# EAGLE schematic baseboard (EAGLE 9.6.1)
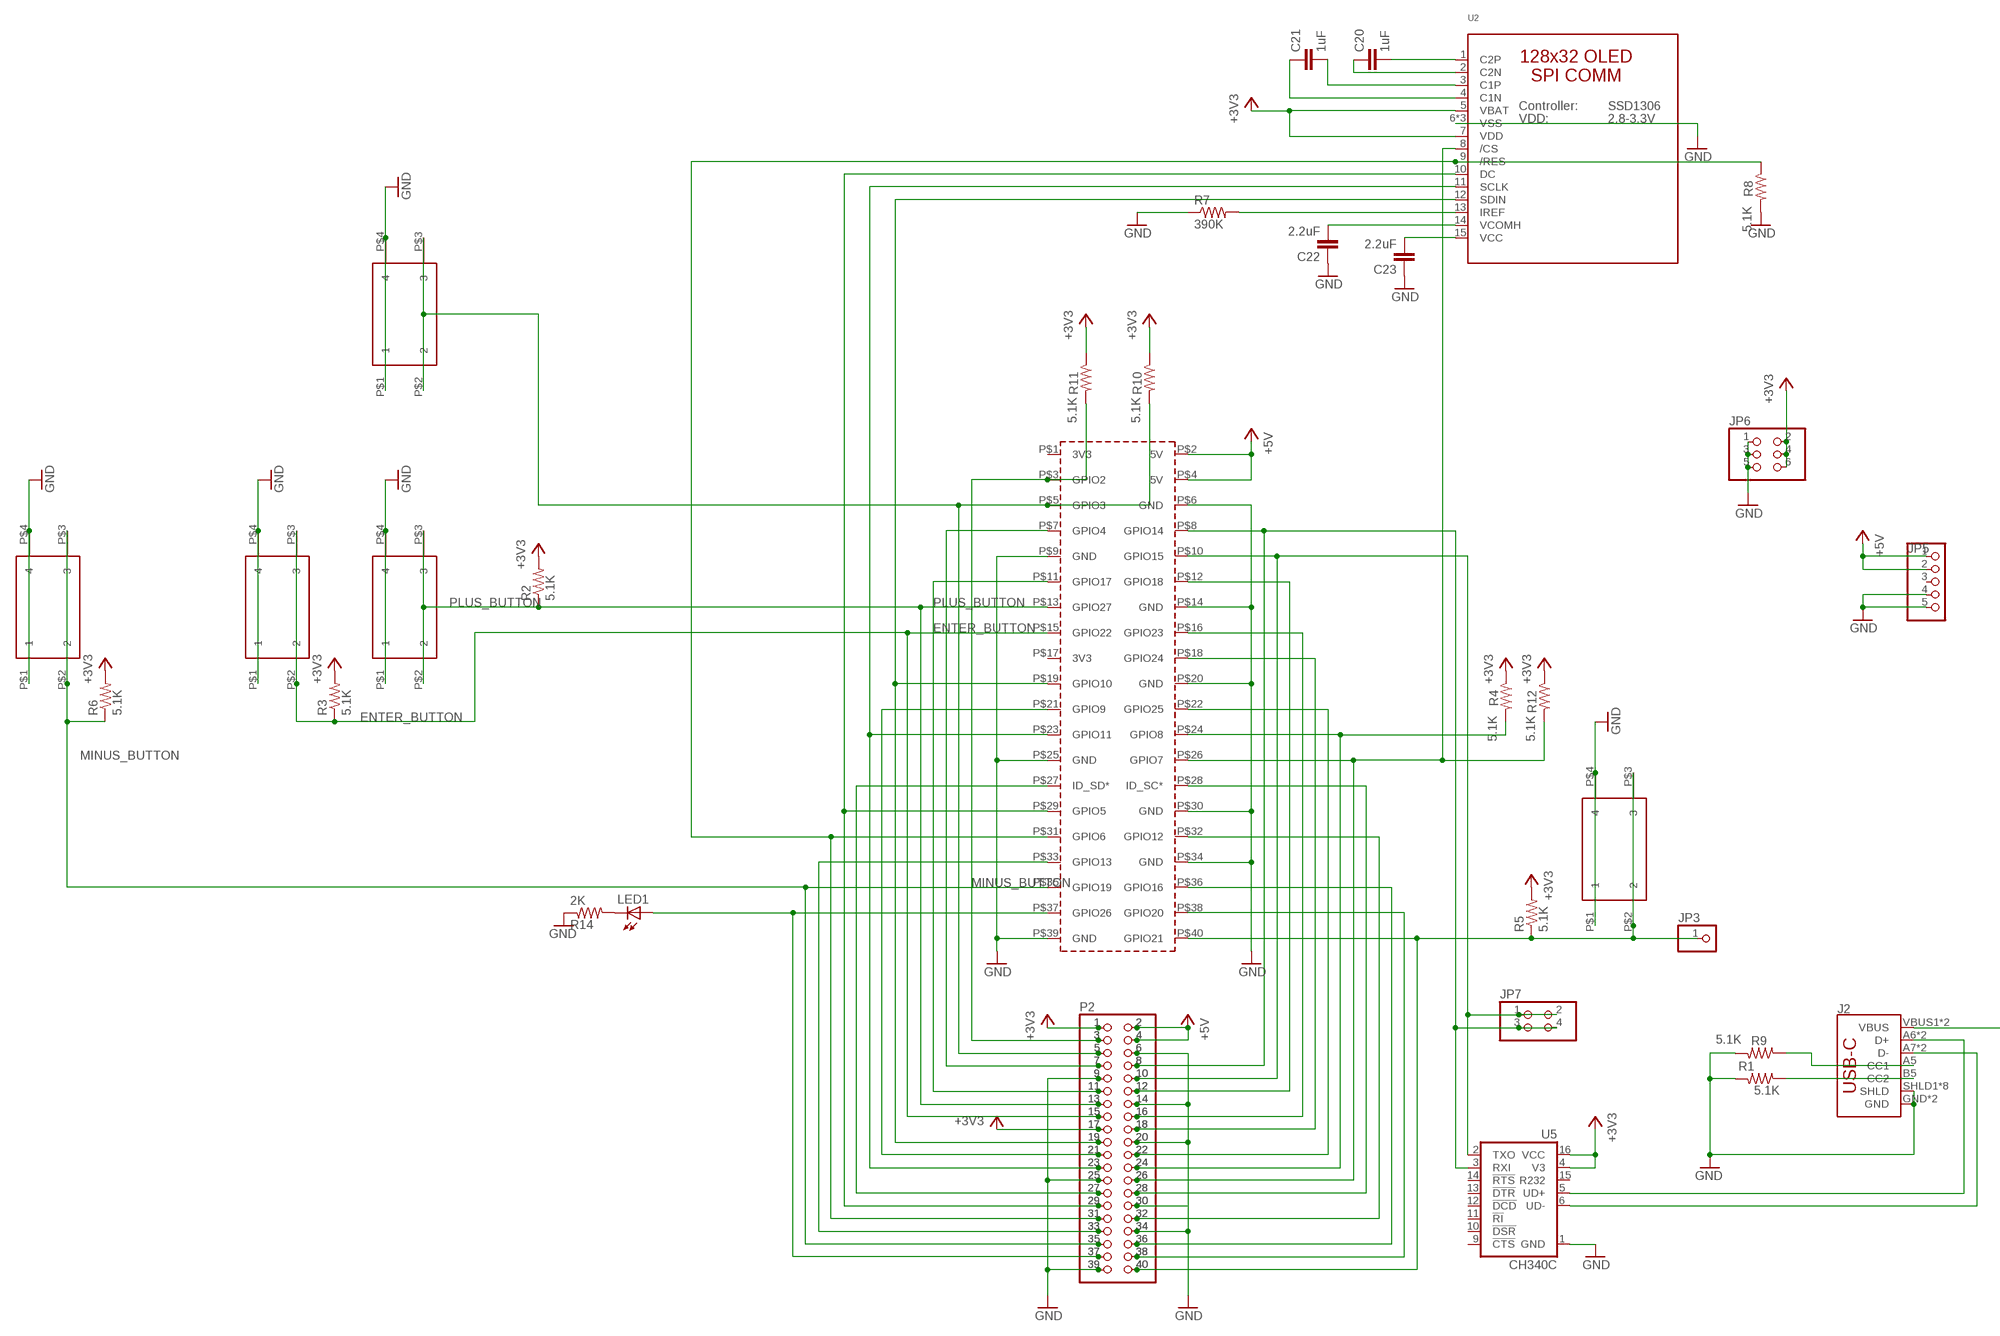
[diagram p0: schematic, sheet 1, part 1 of 2]
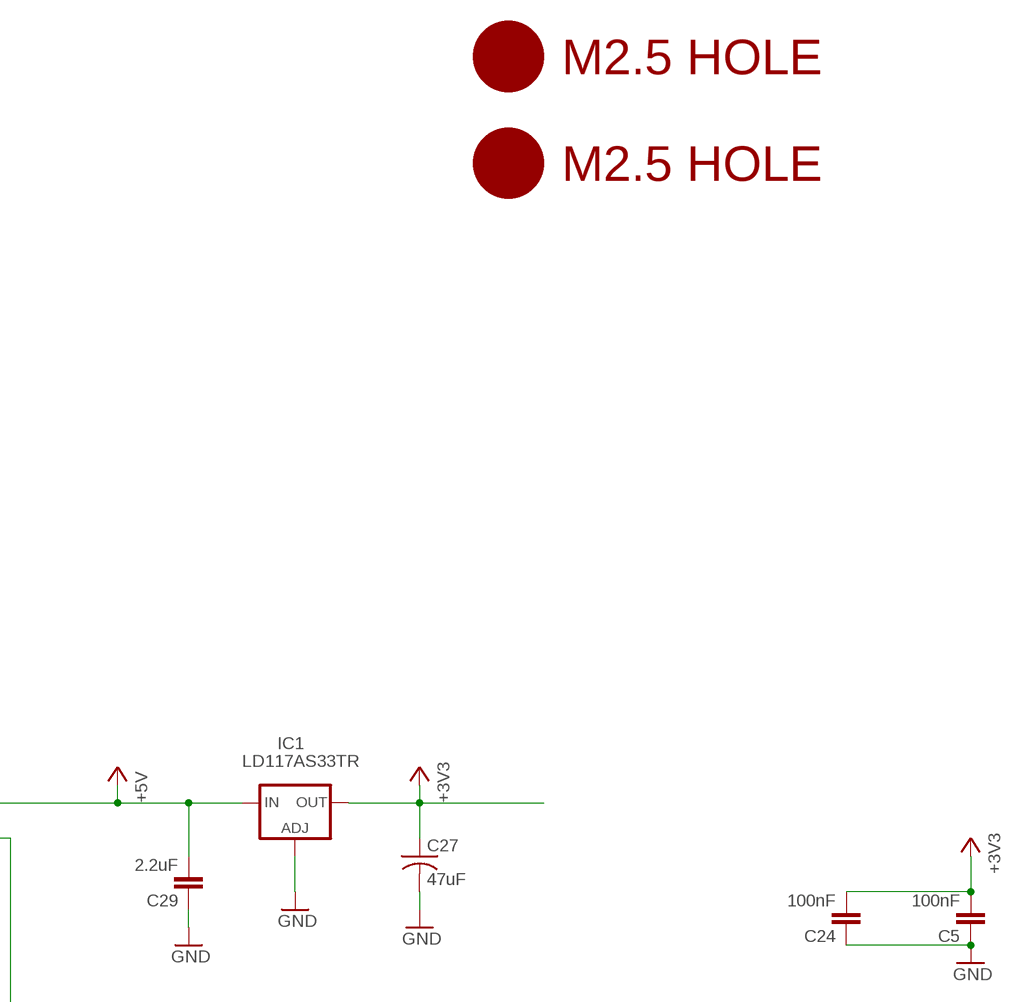
[diagram p1: schematic, sheet 1, part 2 of 2]

## Parts
C5  100nF  CAP0805  [0805]
C20  1uF  CAP0805  [0805]
C21  1uF  CAP0805  [0805]
C22  2.2uF  CAP0805  [0805]
C23  2.2uF  CAP0805  [0805]
C24  100nF  CAP0805  [0805]
C27  47uF  C-USC1210  [C1210]
C29  2.2uF  CAP0805  [0805]
IC1  LD117AS33TR  [SOT223]
J2  USB_C16PIN  [USB-C-16P]
JP3  PINHD-1X1  [1X01]
JP5  PINHD-1X5  [1X05]
JP6  PINHD-2X3  [2X03]
JP7  PINHD-2X2  [2X02]
LED1  LEDCHIP-LED0805  [CHIP-LED0805]
P1  RPI3NO-CONNECTORS  [RPI3-NO-CONNECTORS]
P2  PINHD-2X20-BIG  [2X20-BIG]
P3  PINHD-2X20-BIG  [2X20-BIG]
R1  5.1K  RESISTOR0805-RES  [0805]
R2  5.1K  RESISTOR0805-RES  [0805]
R3  5.1K  RESISTOR0805-RES  [0805]
R4  5.1K  RESISTOR0805-RES  [0805]
R5  5.1K  RESISTOR0805-RES  [0805]
R6  5.1K  RESISTOR0805-RES  [0805]
R7  390K  RESISTOR0805-RES  [0805]
R8  5.1K  RESISTOR0805-RES  [0805]
R9  5.1K  RESISTOR0805-RES  [0805]
R10  5.1K  RESISTOR0805-RES  [0805]
R11  5.1K  RESISTOR0805-RES  [0805]
R12  5.1K  RESISTOR0805-RES  [0805]
R14  2K  RESISTOR0805-RES  [0805]
SW1  324_SW  [342_SWICH_FOOT]
SW2  324_SW  [342_SWICH_FOOT]
SW3  324_SW  [342_SWICH_FOOT]
SW4  324_SW  [342_SWICH_FOOT]
SW20  324_SW  [342_SWICH_FOOT]
U2  LUL_DISP_OLED_UG-2864HSWEG01  [LUL_UG-2864HSWEG01_1.3_WRAPAROUND]
U5  CH340C  [SO016]
U$2  M2.5HOLE  [M2.5HOLE]
U$3  M2.5HOLE  [M2.5HOLE]

## Nets
+3V3: C5.2 C24.2 C27.1 IC1.4(OUT) JP6.2 JP6.4 JP6.6 P2.1 P2.17 P3.1 P3.17 R2.2 R3.2 R4.1 R5.2 R6.2 R10.1 R11.1 R12.1 U2.5(VBAT) U2.7(VDD) U5.4(V3) U5.16(VCC)
+5V: C29.2 IC1.3(IN) J2.VBUS1(VBUS) J2.VBUS2(VBUS) JP5.1 JP5.2 P1.P$2(5V) P1.P$4(5V) P2.2 P2.4 P3.2 P3.4
ENTER_BUTTON: P1.P$15(GPIO22) P2.15 P3.15 R3.1 SW20.P$2 SW20.P$3
GND: C5.1 C22.1 C23.1 C24.1 C27.2 C29.1 IC1.1(ADJ) J2.GND J2.GND2(GND) J2.SHLD1(SHLD) J2.SHLD2(SHLD) J2.SHLD3(SHLD) J2.SHLD4(SHLD) J2.SHLD5(SHLD) J2.SHLD6(SHLD) J2.SHLD7(SHLD) J2.SHLD8(SHLD) JP5.4 JP5.5 JP6.1 JP6.3 JP6.5 P1.P$6(GND) P1.P$9(GND) P1.P$14(GND) P1.P$20(GND) P1.P$25(GND) P1.P$30(GND) P1.P$34(GND) P1.P$39(GND) P2.6 P2.9 P2.14 P2.20 P2.25 P2.30 P2.34 P2.39 P3.6 P3.9 P3.14 P3.20 P3.25 P3.30 P3.34 P3.39 R1.2 R7.1 R8.2 R9.2 R14.1 SW1.P$1 SW1.P$4 SW2.P$1 SW2.P$4 SW3.P$1 SW3.P$4 SW4.P$1 SW4.P$4 SW20.P$1 SW20.P$4 U2.6(VSS) U2.16(VSS) U2.17(VSS) U5.1(GND)
MINUS_BUTTON: P1.P$35(GPIO19) P2.35 P3.35 R6.1 SW4.P$2 SW4.P$3
N$1: J2.A6(D+) J2.B6(D+) U5.5(UD+)
N$2: J2.A5(CC1) R9.1
N$3: J2.A7(D-) J2.B7(D-) U5.6(UD-)
N$4: LED1.A P1.P$37(GPIO26) P2.37 P3.37
N$5: P1.P$3(GPIO2) P2.3 P3.3 R11.2
N$6: P1.P$5(GPIO3) P2.5 P3.5 R10.2 SW2.P$2 SW2.P$3
N$7: J2.B5(CC2) R1.1
N$8: P1.P$7(GPIO4) P2.7 P3.7
N$9: P1.P$11(GPIO17) P2.11 P3.11
N$10: LED1.C R14.2
N$12: P1.P$19(GPIO10) P2.19 P3.19 U2.12(SDIN)
N$13: P1.P$21(GPIO9) P2.21 P3.21
N$14: P1.P$23(GPIO11) P2.23 P3.23 U2.11(SCLK)
N$15: P1.P$27(ID_SD*) P2.27 P3.27
N$16: P1.P$29(GPIO5) P2.29 P3.29 U2.10(DC)
N$19: P1.P$33(GPIO13) P2.33 P3.33
N$22: P1.P$12(GPIO18) P2.12 P3.12
N$23: P1.P$16(GPIO23) P2.16 P3.16
N$24: P1.P$18(GPIO24) P2.18 P3.18
N$25: P1.P$22(GPIO25) P2.22 P3.22
N$26: P1.P$24(GPIO8) P2.24 P3.24 R4.2
N$27: P1.P$26(GPIO7) P2.26 P3.26 R12.2 U2.8(/CS)
N$28: P1.P$28(ID_SC*) P2.28 P3.28
N$29: P1.P$32(GPIO12) P2.32 P3.32
N$30: P1.P$36(GPIO16) P2.36 P3.36
N$31: P1.P$38(GPIO20) P2.38 P3.38
N$32: JP3.1 P1.P$40(GPIO21) P2.40 P3.40 R5.1 SW3.P$2 SW3.P$3
N$35: C20.2 U2.1(C2P)
N$36: C20.1 U2.2(C2N)
N$37: C21.2 U2.3(C1P)
N$38: C21.1 U2.4(C1N)
N$39: R7.2 U2.13(IREF)
N$40: C22.2 U2.14(VCOMH)
N$41: C23.2 U2.15(VCC)
N$43: P1.P$31(GPIO6) P2.31 P3.31 R8.1 U2.9(/RES)
PLUS_BUTTON: P1.P$13(GPIO27) P2.13 P3.13 R2.1 SW1.P$2 SW1.P$3
RPI_RX: JP7.1 JP7.2 P1.P$10(GPIO15) P2.10 P3.10 U5.2(TXO)
RPI_TX: JP7.3 JP7.4 P1.P$8(GPIO14) P2.8 P3.8 U5.3(RXI)
Unconnected: JP5.3 P1.P$1(3V3) P1.P$17(3V3) U5.9(!CTS) U5.10(!DSR) U5.11(!RI) U5.12(!DCD) U5.13(!DTR) U5.14(!RTS) U5.15(R232)

## Library data of the parts
C5 C20-C24 C29 = clock:CAP: Capacitor Standard 0603 ceramic capacitor, and 0.1" leaded capacitor.
C27 = clock:C-US: CAPACITOR, American symbol
IC1 = v-reg:LD117A?*: Low drop fixed and adjustable positive voltage regulators 1 A Source: http://www.st.com/stonline/products/literature/ds/7194/ld1117axx.pdf
J2 = SparkFun-Connectors:USB_C: USB Type C 16Pin Connector Super Speed pins not available on the 16-pin purely SMD connector so this part is best for USB 2.0 implementations. D1 and D2 are tied together enabling D+/- no matter which way the cable is plugged into the connector. The two channel configuration pins (CC1/2) are exposed. These are normally connected to ground via 5.1k resistors but can be reconfigured for high current/high power applications.; PROD_ID: CONN-14122
JP3 = adafruit_changed:PINHD-1X1: Pin header 1x1 for 0.1" spacing With round pins
JP5 = pinhead:PINHD-1X5: PIN HEADER
JP6 = pinhead:PINHD-2X3: PIN HEADER
JP7 = pinhead:PINHD-2X2: PIN HEADER
LED1 = adafruit:LED: LED OSRAM: - CHIPLED LG R971, LG N971, LY N971, LG Q971, LY Q971, LO R971, LY R971 LH N974, LH R974 LS Q976, LO Q976, LY Q976 LO Q996 - Hyper CHIPLED LW Q18S LB Q993, LB Q99A, LB R99A - SideLED LS A670, LO A670, LY A670, LG A670, LP A670 LB A673, LV A673, LT A673, LW A673 LH A674 LY A675 LS A676, LA A676, LO A676, LY A676, LW A676 LS A679, LY A679, LG A679 - Hyper Micro SIDELED® LS Y876, LA Y876, LO Y876, LY Y876 LT Y87S - SmartLED LW L88C, LW L88S LB L89C, LB L89S, LG L890 LS L89K, LO L89K, LY L89K LS L896, LA L896, LO L896, LY L896 - TOPLED LS T670, LO T670, LY T670, LG T670, LP T670 LSG T670, LSP T670, LSY T670, LOP T670, LYG T670 LG T671, LOG T671, LSG T671 LB T673, LV T673, LT T673, LW T673 LH T674 LS T676, LA T676, LO T676, LY T676, LB T676, LH T676, LSB T676, LW T676 LB T67C, LV T67C, LT T67C, LS T67K, LO T67K, LY T67K, LW E67C LS E67B, LA E67B, LO E67B, LY E67B, LB E67C, LV E67C, LT E67C LW T67C LS T679, LY T679, LG T679 LS T770, LO T770, LY T770, LG T770, LP T770 LB T773, LV T773, LT T773, LW T773 LH T774 LS E675, LA E675, LY E675, LS T675 LS T776, LA T776, LO T776, LY T776, LB T776 LHGB T686 LT T68C, LB T68C - Hyper Mini TOPLED® LB M676 - Mini TOPLED Santana® LG M470 LS M47K, LO M47K, LY M47K Source: http://www.osram.convergy.de/
P1 = e14_Rpi3_RevA:RPI3: Device for Raspberry Pi 3 board created by Dave Young for www.element14.com More information and support community is available at https://www.element14.com/community/community/raspberry-pi
P2 P3 = adafruit_changed:PINHD-2X20: PIN HEADER
R1 R4 R8-R12 = joyAnalog:RESISTOR: Resistor Basic schematic elements and footprints for 0603, 1206, and PTH resistors.
R2 R3 R5-R7 R14 = SparkFun-Passives:RESISTOR: Resistor Basic schematic elements and footprints for 0603, 1206, and PTH resistors.
SW1-SW4 SW20 = 3pos_slide_switch_centered:324_SW
U2 = lul:LUL_DISP_OLED_UG-2864HSWEG01: UG-2864HSWEG01 OLED display Both 1.3" and 0.96" models share the same FPC tab footprint, only the screen dimensions vary.
U5 = SparkFun-IC-Comms:CH340C; PROD_ID: IC-14038
U$2 U$3 = f1c100s:M2.5HOLE

## Net classes
1 power: width 0.178 mm